# Altium schematic sheet 1x9x1_3.SchDoc
size A; SheetNumber: 3; SheetTotal: 3
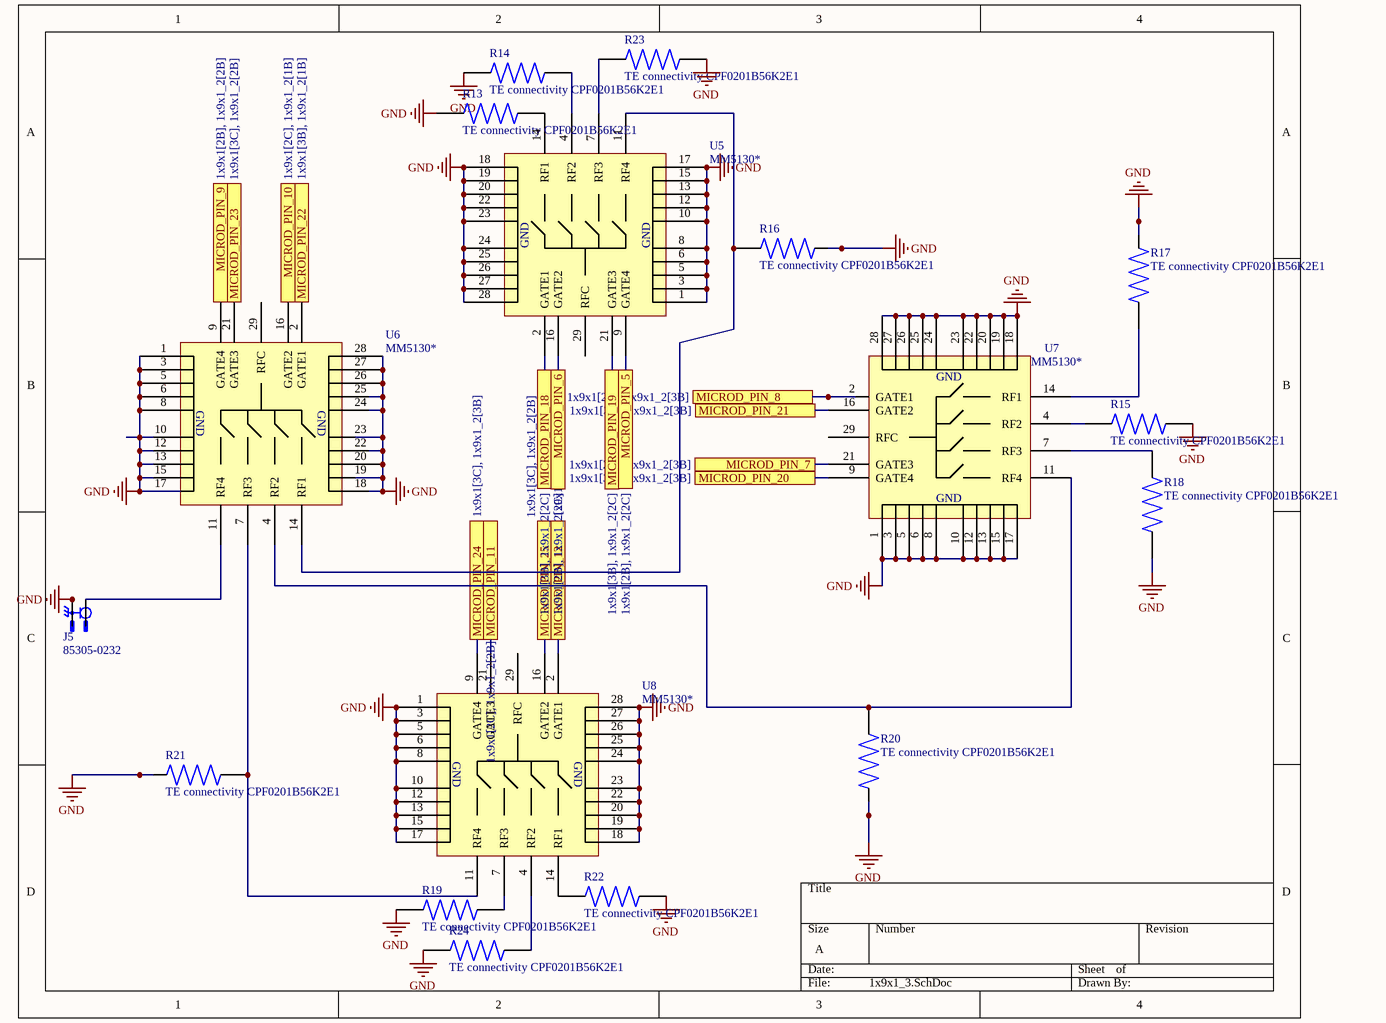
[diagram p0: 1x9x1_3.SchDoc]

## Parts
J5  85305-0232  [MOLEX_85305-0232]
R13  TE connectivity CPF0201B56K2E1  [0201-resistor]
R14  TE connectivity CPF0201B56K2E1  [0201-resistor]
R15  TE connectivity CPF0201B56K2E1  [0201-resistor]
R16  TE connectivity CPF0201B56K2E1  [0201-resistor]
R17  TE connectivity CPF0201B56K2E1  [0201-resistor]
R18  TE connectivity CPF0201B56K2E1  [0201-resistor]
R19  TE connectivity CPF0201B56K2E1  [0201-resistor]
R20  TE connectivity CPF0201B56K2E1  [0201-resistor]
R21  TE connectivity CPF0201B56K2E1  [0201-resistor]
R22  TE connectivity CPF0201B56K2E1  [0201-resistor]
R23  TE connectivity CPF0201B56K2E1  [0201-resistor]
R24  TE connectivity CPF0201B56K2E1  [0201-resistor]
U5  MM5130*  [MM5130-NORM_PCB_NOFLOOD]
U6  MM5130*  [MM5130-NORM_PCB_NOFLOOD]
U7  MM5130*  [MM5130-NORM_PCB_NOFLOOD]
U8  MM5130*  [MM5130-NORM_PCB_NOFLOOD]

## Ports
MICROD_PIN_5 (see 1x9x1[2B], 1x9x1_2[2C]), MICROD_PIN_6 (see 1x9x1[2B], 1x9x1_2[2C]), MICROD_PIN_7 (see 1x9x1[2B], 1x9x1_2[3B]), MICROD_PIN_8 (see 1x9x1[2B], 1x9x1_2[3B]), MICROD_PIN_9 (see 1x9x1[2B], 1x9x1_2[2B]), MICROD_PIN_10 (see 1x9x1[2C], 1x9x1_2[1B]), MICROD_PIN_11 (see 1x9x1[2C], 1x9x1_2[2B]), MICROD_PIN_12 (see 1x9x1[2C], 1x9x1_2[3B]), MICROD_PIN_18 (see 1x9x1[3B], 1x9x1_2[2C]), MICROD_PIN_19 (see 1x9x1[3B], 1x9x1_2[2C]), MICROD_PIN_20 (see 1x9x1[3B], 1x9x1_2[3B]), MICROD_PIN_21 (see 1x9x1[3B], 1x9x1_2[3B]), MICROD_PIN_22 (see 1x9x1[3B], 1x9x1_2[1B]), MICROD_PIN_23 (see 1x9x1[3C], 1x9x1_2[2B]), MICROD_PIN_24 (see 1x9x1[3C], 1x9x1_2[3B]), MICROD_PIN_25 (see 1x9x1[3C], 1x9x1_2[2B])

## Nets
GND: J5.2 J5.3 J5.4 J5.5 J5.6 J5.7 J5.8 J5.9 J5.10 J5.11 J5.12 J5.13 J5.14 J5.15 J5.16 J5.17 J5.18 R13.1 R14.2 R15.2 R16.1 R17.1 R18.1 R19.1 R20.2 R21.2 R22.1 R23.1 R24.1 U5.1(GND) U5.3(GND) U5.5(GND) U5.6(GND) U5.8(GND) U5.10(GND) U5.12(GND) U5.13(GND) U5.15(GND) U5.17(GND) U5.18(GND) U5.19(GND) U5.20(GND) U5.22(GND) U5.23(GND) U5.24(GND) U5.25(GND) U5.26(GND) U5.27(GND) U5.28(GND) U6.1(GND) U6.3(GND) U6.5(GND) U6.6(GND) U6.8(GND) U6.10(GND) U6.12(GND) U6.13(GND) U6.15(GND) U6.17(GND) U6.18(GND) U6.19(GND) U6.20(GND) U6.22(GND) U6.23(GND) U6.24(GND) U6.25(GND) U6.26(GND) U6.27(GND) U6.28(GND) U7.1(GND) U7.3(GND) U7.5(GND) U7.6(GND) U7.8(GND) U7.10(GND) U7.12(GND) U7.13(GND) U7.15(GND) U7.17(GND) U7.18(GND) U7.19(GND) U7.20(GND) U7.22(GND) U7.23(GND) U7.24(GND) U7.25(GND) U7.26(GND) U7.27(GND) U7.28(GND) U8.1(GND) U8.3(GND) U8.5(GND) U8.6(GND) U8.8(GND) U8.10(GND) U8.12(GND) U8.13(GND) U8.15(GND) U8.17(GND) U8.18(GND) U8.19(GND) U8.20(GND) U8.22(GND) U8.23(GND) U8.24(GND) U8.25(GND) U8.26(GND) U8.27(GND) U8.28(GND)
MICROD_PIN_5: U5.9(GATE4) ; port MICROD_PIN_5
MICROD_PIN_6: U5.16(GATE2) ; port MICROD_PIN_6
MICROD_PIN_7: U7.21(GATE3) ; port MICROD_PIN_7
MICROD_PIN_8: U7.2(GATE1) ; port MICROD_PIN_8
MICROD_PIN_9: U6.9(GATE4) ; port MICROD_PIN_9
MICROD_PIN_10: U6.16(GATE2) ; port MICROD_PIN_10
MICROD_PIN_11: U8.21(GATE3) ; port MICROD_PIN_11
MICROD_PIN_12: U8.2(GATE1) ; port MICROD_PIN_12
MICROD_PIN_18: U5.2(GATE1) ; port MICROD_PIN_18
MICROD_PIN_19: U5.21(GATE3) ; port MICROD_PIN_19
MICROD_PIN_20: U7.9(GATE4) ; port MICROD_PIN_20
MICROD_PIN_21: U7.16(GATE2) ; port MICROD_PIN_21
MICROD_PIN_22: U6.2(GATE1) ; port MICROD_PIN_22
MICROD_PIN_23: U6.21(GATE3) ; port MICROD_PIN_23
MICROD_PIN_24: U8.9(GATE4) ; port MICROD_PIN_24
MICROD_PIN_25: U8.16(GATE2) ; port MICROD_PIN_25
NetJ5_1: J5.1 U6.11(RF4)
NetR13_2: R13.2 U5.14(RF1)
NetR14_1: R14.1 U5.4(RF2)
NetR15_1: R15.1 U7.4(RF2)
NetR16_2: R16.2 U5.11(RF4) U6.14(RF1)
NetR17_2: R17.2 U7.14(RF1)
NetR18_2: R18.2 U7.7(RF3)
NetR19_2: R19.2 U8.7(RF3)
NetR20_1: R20.1 U6.4(RF2) U7.11(RF4)
NetR21_1: R21.1 U6.7(RF3) U8.11(RF4)
NetR22_2: R22.2 U8.14(RF1)
NetR23_2: R23.2 U5.7(RF3)
NetR24_2: R24.2 U8.4(RF2)

Not connected (* = marked no-connect by the designer): U5 29(RFC); U6 29(RFC); U7 29(RFC); U8 29(RFC)

## Library data of the parts
J5 = 85305-0232: SMP Connector Plug, Male Pin 50Ohm Surface Mount Solder; MP: 853050232; MF: Molex; Check_prices: https://www.snapeda.com/parts/853050232/Molex/view-part/?ref=eda; Value: *; Availability: In Stock; Price: None; Package: None; SnapEDA_Link: https://www.snapeda.com/parts/853050232/Molex/view-part/?ref=snap; Purchase-URL: https://pricing.snapeda.com/search/part/853050232/?ref=eda
R13-R24 = TE connectivity CPF0201B56K2E1: CPF 0201 56K2 0.1% 25PPM 1K RL; MP: ERJ1GN0R00C; Value: 56k; Availability: Unavailable; Price: None; Package: None; Mfgr: TE connectivity; Mfgr Part No.: CPF0201B56K2E1
U5-U8 = IC-MM5130: High power SP4T MEMs switch